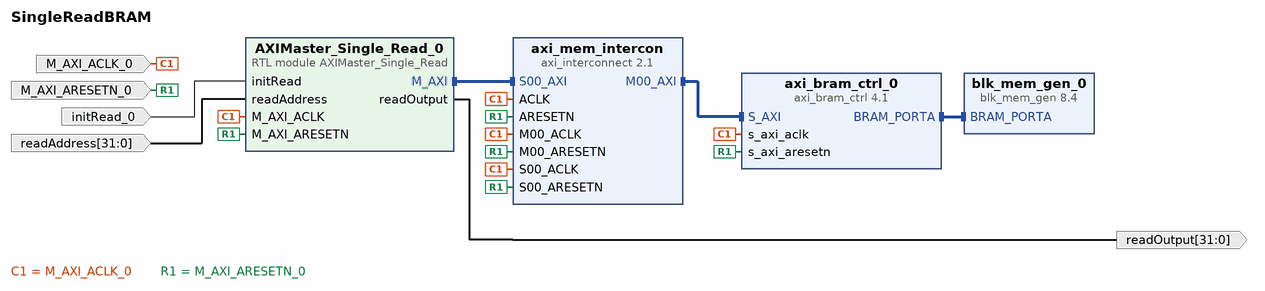
[diagram p0: block diagram of the top level]
# Vivado block design SingleReadBRAM, xc7z010clg400-1, Vivado 2019.1
create_bd_design SingleReadBRAM

create_bd_port -dir I initRead_0
create_bd_port -dir I -type clk M_AXI_ACLK_0
create_bd_port -dir I -type rst M_AXI_ARESETN_0
create_bd_port -dir I -from 31 -to 0 readAddress
create_bd_port -dir O -from 31 -to 0 readOutput

create_bd_cell -type ip -vlnv xilinx.com:ip:axi_bram_ctrl:4.1 axi_bram_ctrl_0
set_property -dict {CONFIG.PROTOCOL AXI4LITE CONFIG.SINGLE_PORT_BRAM 1} [get_bd_cells axi_bram_ctrl_0]
create_bd_cell -type ip -vlnv xilinx.com:ip:blk_mem_gen:8.4 blk_mem_gen_0
set_property -dict [list \
  CONFIG.Coe_File ../../../../../../../MemFiles/SampleMemFile.coe \
  CONFIG.Load_Init_File true \
  CONFIG.Memory_Type Single_Port_ROM \
  CONFIG.Port_A_Write_Rate 0 \
] [get_bd_cells blk_mem_gen_0]
create_bd_cell -type ip -vlnv xilinx.com:ip:axi_interconnect:2.1 axi_mem_intercon
set_property -dict {CONFIG.NUM_MI 1} [get_bd_cells axi_mem_intercon]
create_bd_cell -type module -reference AXIMaster_Single_Read AXIMaster_Single_Read_0

# ---- connections ----

connect_bd_intf_net [get_bd_intf_pins AXIMaster_Single_Read_0/M_AXI] [get_bd_intf_pins axi_mem_intercon/S00_AXI]
connect_bd_intf_net [get_bd_intf_pins axi_mem_intercon/M00_AXI] [get_bd_intf_pins axi_bram_ctrl_0/S_AXI]
connect_bd_intf_net [get_bd_intf_pins blk_mem_gen_0/BRAM_PORTA] [get_bd_intf_pins axi_bram_ctrl_0/BRAM_PORTA]
connect_bd_net -net M_AXI_ACLK_0_1 [get_bd_ports M_AXI_ACLK_0] \
  [get_bd_pins axi_mem_intercon/ACLK] [get_bd_pins axi_mem_intercon/S00_ACLK] [get_bd_pins axi_mem_intercon/M00_ACLK] \
  [get_bd_pins axi_bram_ctrl_0/s_axi_aclk] [get_bd_pins AXIMaster_Single_Read_0/M_AXI_ACLK]
connect_bd_net -net M_AXI_ARESETN_0_1 [get_bd_ports M_AXI_ARESETN_0] \
  [get_bd_pins axi_mem_intercon/ARESETN] [get_bd_pins axi_mem_intercon/S00_ARESETN] \
  [get_bd_pins axi_mem_intercon/M00_ARESETN] [get_bd_pins axi_bram_ctrl_0/s_axi_aresetn] \
  [get_bd_pins AXIMaster_Single_Read_0/M_AXI_ARESETN]
connect_bd_net -net initRead_0_1 [get_bd_ports initRead_0] [get_bd_pins AXIMaster_Single_Read_0/initRead]
connect_bd_net [get_bd_ports readAddress] [get_bd_pins AXIMaster_Single_Read_0/readAddress]
connect_bd_net [get_bd_pins AXIMaster_Single_Read_0/readOutput] [get_bd_ports readOutput]

# ---- address map ----
assign_bd_address -offset 0xC0000000 -range 8K -target_address_space [get_bd_addr_spaces AXIMaster_Single_Read_0/M_AXI] [get_bd_addr_segs axi_bram_ctrl_0/S_AXI/Mem0]

validate_bd_design
save_bd_design
